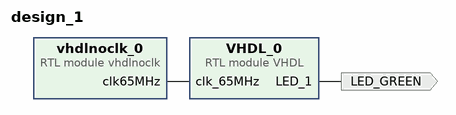
[diagram p0: block diagram of the top level]
# Vivado block design design_1, xc7z007sclg225-1, Vivado 2019.2
create_bd_design design_1

create_bd_port -dir O LED_GREEN

create_bd_cell -type module -reference vhdlnoclk vhdlnoclk_0
create_bd_cell -type module -reference VHDL VHDL_0

# ---- connections ----

connect_bd_net [get_bd_pins vhdlnoclk_0/clk65MHz] [get_bd_pins VHDL_0/clk_65MHz]
connect_bd_net [get_bd_pins VHDL_0/LED_1] [get_bd_ports LED_GREEN]

validate_bd_design
save_bd_design
